# Altium schematic sheet BWP08.SCHDOC
size A4
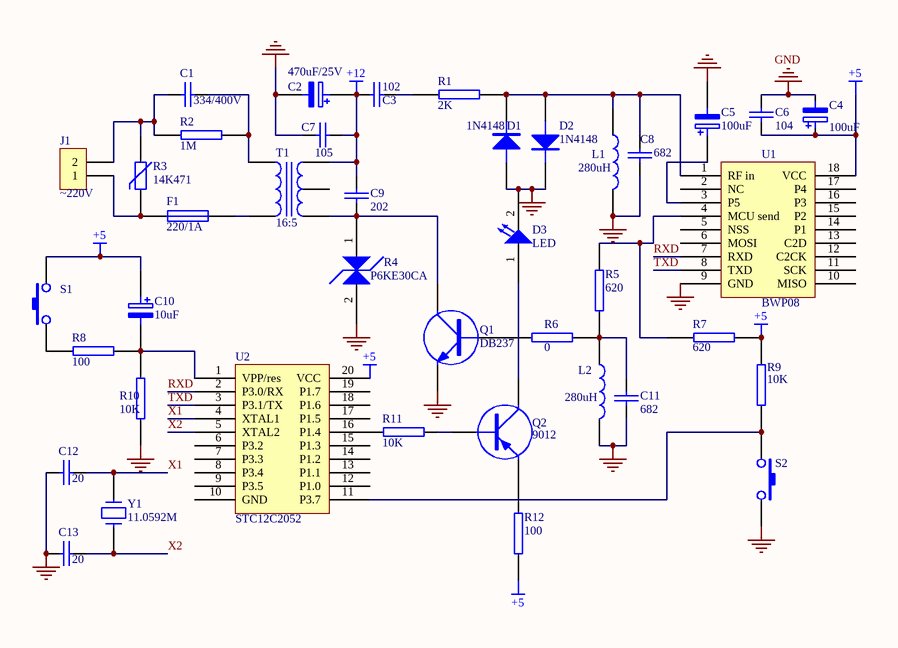
[diagram p0: BWP08.SCHDOC]

## Parts
C1  334/400V  [CAP_CBB]
C2  470uF/25V  [0805]
C3  102  [0805]
C4  100uF  [0805]
C5  100uF  [0805]
C6  104  [0805]
C7  105  [0805]
C8  682  [0805]
C9  202  [0805]
C10  10uF  [RB.2/.4]
C11  682  [0805]
C12  20  [0805]
C13  20  [0805]
D1  1N4148  [SMT_DI]
D2  1N4148  [SMT_DI]
D3  LED  [RAD0.1]
F1  220/1A  [FUSE_R]
J1  ~220V  [MY_MAIN]
L1  280uH  [AXIAL0.4]
L2  280uH  [AXIAL0.4]
Q1  DB237  [TO-92B]
Q2  9012  [SOT-23]
R1  2K  [0805]
R2  1M  [0805]
R3  14K471  [PVR1]
R4  P6KE30CA  [SMBJ20]
R5  620  [0805]
R6  0  [0805]
R7  620  [0805]
R8  100  [0805]
R9  10K  [0805]
R10  10K  [0805]
R11  10K  [0805]
R12  100  [0805]
S1  (no value)  [TT4]
S2  (no value)  [TT4]
T1  16:5  [M5]
U1  BWP08
U2  STC12C2052  [DIP20]
Y1  11.0592M  [CRYSTAL_M]

## Nets
+5: C4.1 C6.1 C10.1 R7.1 R9.1 R12.1 S1.2 U1.18(VCC) U2.20(VCC)
+12: C2.1 C3.1 C7.1 C9.1 T1.2
GND: C2.2 C4.2 C5.2 C6.2 C7.2 C8.2 C11.2 C12.1 C13.1 D1.1(A) D2.2(K) D3.2 L1.2 L2.2 Q1.3(E) R4.2 R10.2 S2.2 U1.9(GND)
RXD: U1.7(RXD) U2.2(P3.0/RX)
TXD: U1.8(TXD) U2.3(P3.1/TX)
X1: C12.2 U2.4(XTAL1) Y1.2
X2: C13.2 U2.5(XTAL2) Y1.1
NetC1_1: C1.1 J1.2 R2.1 R3.1
NetC1_2: C1.2 R2.2 T1.1
NetC3_2: C3.2 R1.1
NetC5_1: C5.1 U1.3(P5)
NetC8_1: C8.1 D1.2(K) D2.1(A) L1.1 R1.2 U1.1(RF_in)
NetC9_2: C9.2 Q1.2(C) R4.1 T1.5
NetC10_2: C10.2 R8.1 R10.1 U2.1(VPP/res)
NetC11_1: C11.1 L2.1 R5.1 R6.1
NetD3_1: D3.1 Q2.3(C)
NetF1_1: F1.1 T1.4
NetF1_2: F1.2 J1.1 R3.2
NetQ1_1: Q1.1(B) R6.2
NetQ2_1: Q2.1(B) R11.1
NetQ2_2: Q2.2(E) R12.2
NetR5_2: R5.2 R7.2 U1.4(MCU_send)
NetR8_2: R8.2 S1.1
NetR9_2: R9.2 S2.1 U2.11(P3.7)
NetR11_2: R11.2 U2.16(P1.4)

Not connected (* = marked no-connect by the designer): T1 3; U1 2(NC) 5(NSS) 6(MOSI) 10(MISO) 11(SCK) 12(C2CK) 13(C2D) 14(P1) 15(P2) 16(P3) 17(P4); U2 6(P3.2) 7(P3.3) 8(P3.4) 9(P3.5) 10(GND) 12(P1.0) 13(P1.1) 14(P1.2) 15(P1.3) 17(P1.5) 18(P1.6) 19(P1.7)

## Library data of the parts
C1 C3 C6-C9 C11-C13 = CAP: Capacitor
C2 C4 C5 C10 = ELECTRO2: Electrolytic Capacitor
D1 D2 = DIODE
F1 = FUSE1: Fuse
J1 = CON2: Connector
L1 L2 = INDUCTOR1
Q1 = NPN: NPN Transistor
Q2 = PNP: PNP Transistor
R1 R2 R5-R12 = RES2
R3 = VARISTOR
R4 = YIZHIQI
S1 S2 = SW-PB
T1 = TRANS4
U2 = STC12C4052
Y1 = CRYSTAL